# EAGLE schematic schematic_projektpraktikum_v2 (EAGLE 7.7.0)
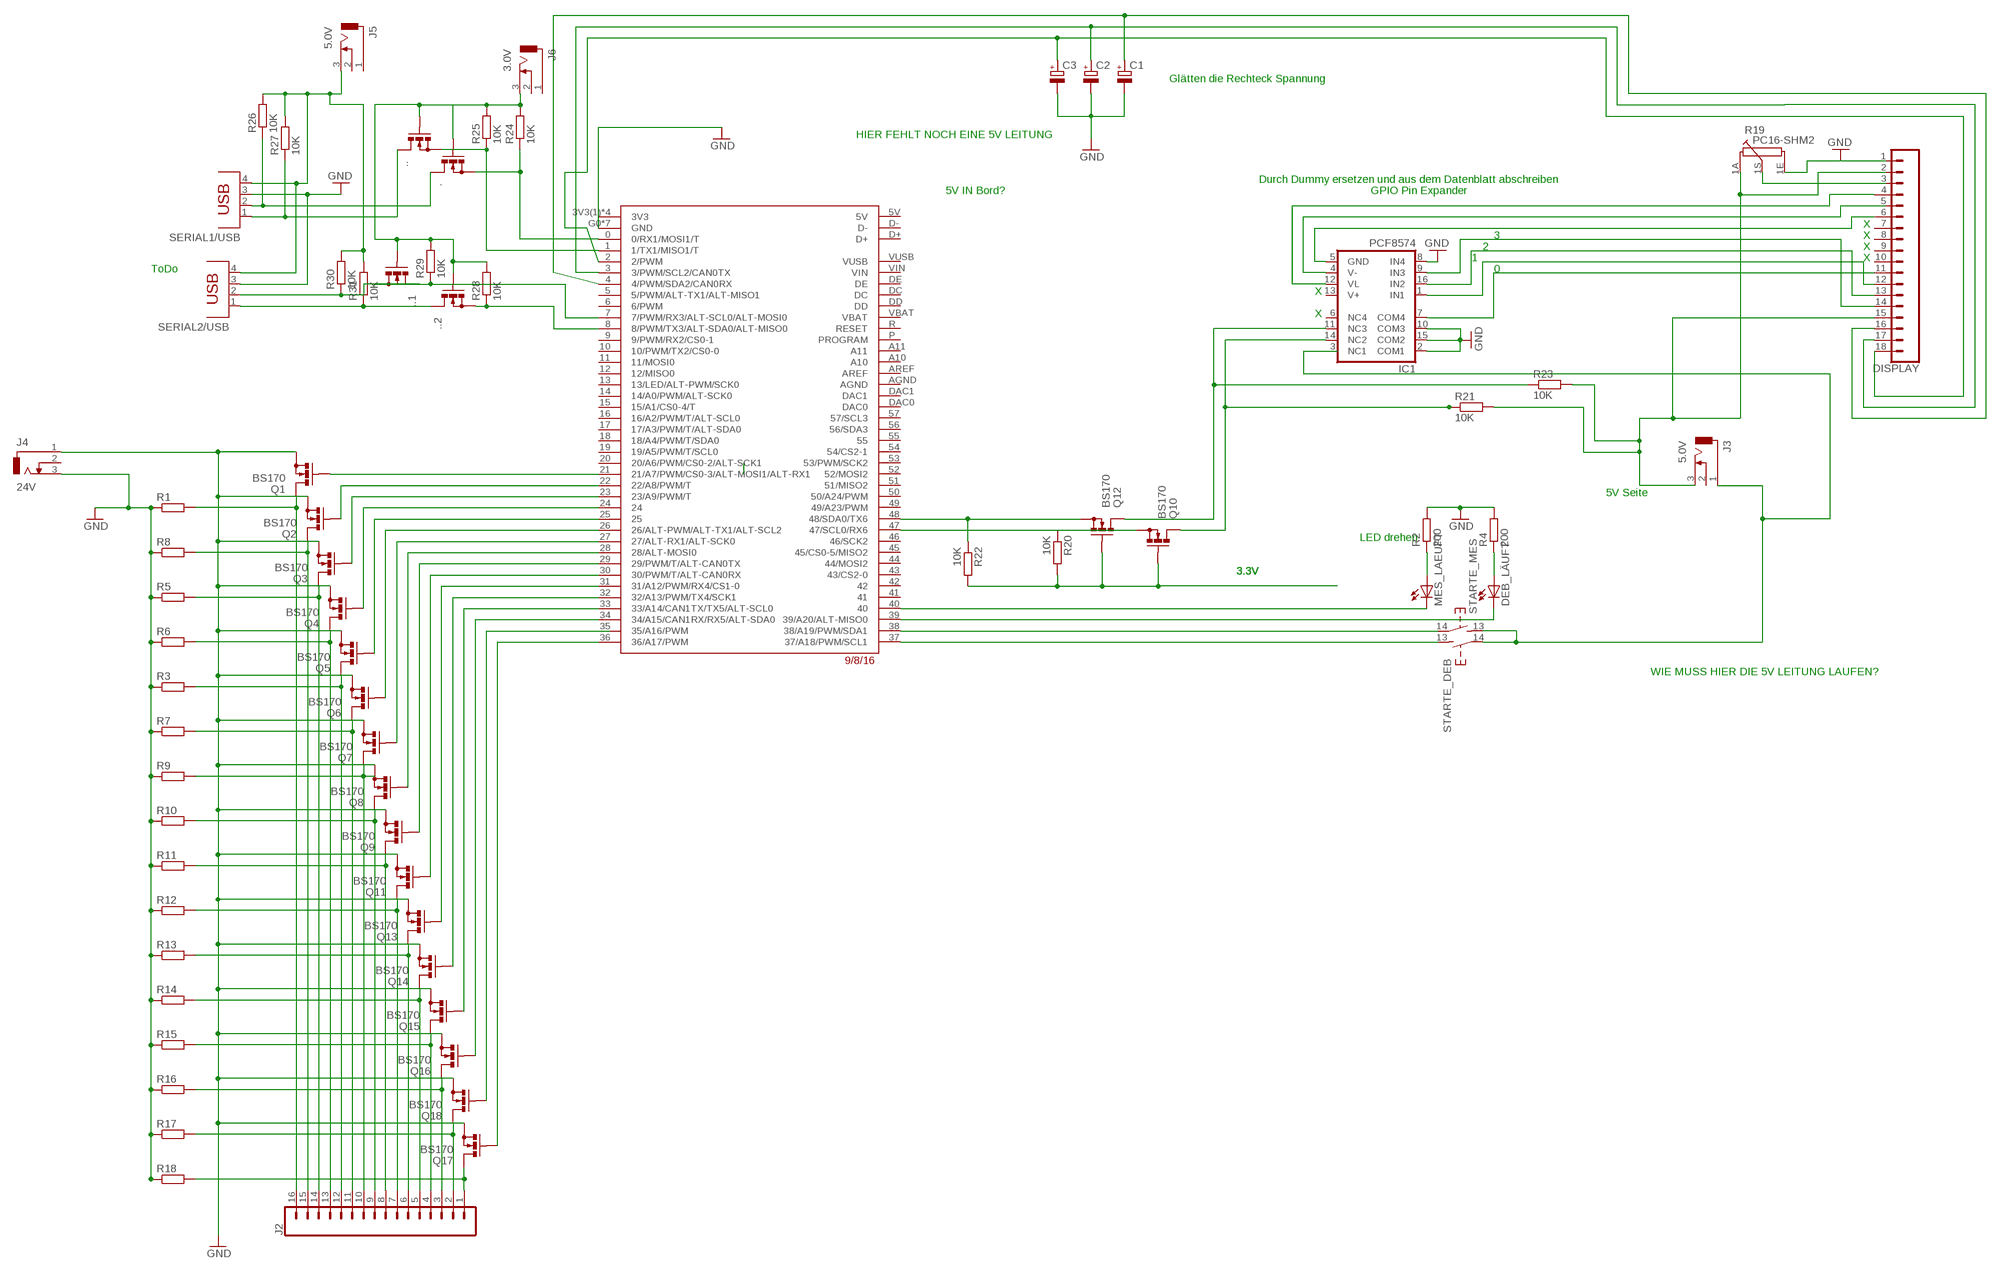
[diagram p0: schematic, sheet 1]

## Parts
.  BS170  [SOT54E]
..  BS170  [SOT54E]
..1  BS170  [SOT54E]
..2  BS170  [SOT54E]
C1  CPOL-EUE25-10AXIAL  [E25-10]
C2  CPOL-EUE25-10AXIAL  [E25-10]
C3  CPOL-EUE25-10AXIAL  [E25-10]
DEB_LÄUFT  LED5MM  [LED5MM]
DISPLAY  CONN_18  [1X18]
IC1  PCF8574  MAX312PE  [DIL16]
J2  CONN_16  [1X16]
J3  5.0V  DCJ0303  [DCJ0303]
J4  24V  DCJ0303  [DCJ0303]
J5  5.0V  DCJ0303  [DCJ0303]
J6  3.0V  DCJ0303  [DCJ0303]
MES_LAEUFT  LED5MM  [LED5MM]
Q1  BS170  [SOT54E]
Q2  BS170  [SOT54E]
Q3  BS170  [SOT54E]
Q4  BS170  [SOT54E]
Q5  BS170  [SOT54E]
Q6  BS170  [SOT54E]
Q7  BS170  [SOT54E]
Q8  BS170  [SOT54E]
Q9  BS170  [SOT54E]
Q10  BS170  [SOT54E]
Q11  BS170  [SOT54E]
Q12  BS170  [SOT54E]
Q13  BS170  [SOT54E]
Q14  BS170  [SOT54E]
Q15  BS170  [SOT54E]
Q16  BS170  [SOT54E]
Q17  BS170  [SOT54E]
Q18  BS170  [SOT54E]
R1  R-EU_0411/15  [0411/15]
R2  200  R-EU_0204/5  [0204/5]
R3  R-EU_0411/15  [0411/15]
R4  200  R-EU_0204/5  [0204/5]
R5  R-EU_0411/15  [0411/15]
R6  R-EU_0411/15  [0411/15]
R7  R-EU_0411/15  [0411/15]
R8  R-EU_0411/15  [0411/15]
R9  R-EU_0411/15  [0411/15]
R10  R-EU_0411/15  [0411/15]
R11  R-EU_0411/15  [0411/15]
R12  R-EU_0411/15  [0411/15]
R13  R-EU_0411/15  [0411/15]
R14  R-EU_0411/15  [0411/15]
R15  R-EU_0411/15  [0411/15]
R16  R-EU_0411/15  [0411/15]
R17  R-EU_0411/15  [0411/15]
R18  R-EU_0411/15  [0411/15]
R19  PC16-SHM2  [PC16-SHM2]
R20  10K  R-EU_0411/15  [0411/15]
R21  10K  R-EU_0411/15  [0411/15]
R22  10K  R-EU_0411/15  [0411/15]
R23  10K  R-EU_0411/15  [0411/15]
R24  10K  R-EU_0411/15  [0411/15]
R25  10K  R-EU_0411/15  [0411/15]
R26  10K  R-EU_0411/15  [0411/15]
R27  10K  R-EU_0411/15  [0411/15]
R28  10K  R-EU_0411/15  [0411/15]
R29  10K  R-EU_0411/15  [0411/15]
R30  10K  R-EU_0411/15  [0411/15]
R31  10K  R-EU_0411/15  [0411/15]
SERIAL1/USB  PN87520  [PN87520]
SERIAL2/USB  PN87520  [PN87520]
STARTE_DEB  TASTER_SCHLIESSER  [EINTASTER]
STARTE_MES  TASTER_SCHLIESSER  [EINTASTER]
U$1  TEENSY3_6--ALLPINS  [T36]

## Nets
.: ..D R26.1 SERIAL1/USB.2
DISPLAY: J5.3 R26.2 R27.2 R30.2 R31.2 SERIAL1/USB.4 SERIAL2/USB.4
GND: C1.- C2.- C3.- IC1.2(COM1) IC1.8(IN4) IC1.10(COM3) IC1.15(COM2) J4.3 R1.1 R2.2 R3.1 R4.2 R5.1 R6.1 R7.1 R8.1 R9.1 R10.1 R11.1 R12.1 R13.1 R14.1 R15.1 R16.1 R17.1 R18.1 R19.1E SERIAL1/USB.3 SERIAL2/USB.3 U$1.G0(GND) U$1.G1(GND) U$1.G2(GND) U$1.G3(GND) U$1.G4(GND) U$1.G5(GND) U$1.G6(GND)
N$1: ...S R25.1 U$1.1(1/TX1/MISO1/T)
N$2: ..1.S R29.1 U$1.7(7/PWM/RX3/ALT-SCL0/ALT-MOSI0)
N$3: ..1.D R30.1 SERIAL2/USB.2
N$5: ..2.D R31.1 SERIAL2/USB.1
N$8: STARTE_MES.14 U$1.38(38/A19/PWM/SDA1)
N$9: J2.16 Q1.D R1.2
N$12: J4.1 Q1.S Q2.S Q3.S Q4.S Q5.S Q6.S Q7.S Q8.S Q9.S Q11.S Q13.S Q14.S Q15.S Q16.S Q17.S Q18.S
N$13: Q1.G U$1.21(21/A7/PWM/CS0-3/ALT-MOSI1/ALT-RX1)
N$14: J2.14 Q3.D R5.2
N$15: MES_LAEUFT.A R2.1
N$16: MES_LAEUFT.K(C) U$1.40
N$17: DEB_LÄUFT.A R4.1
N$18: DEB_LÄUFT.K(C) U$1.39(39/A20/ALT-MISO0)
N$19: STARTE_DEB.13 U$1.37(37/A18/PWM/SCL1)
N$20: Q2.G U$1.22(22/A8/PWM/T)
N$21: J2.13 Q4.D R6.2
N$22: J2.12 Q5.D R3.2
N$23: Q4.G U$1.24
N$24: Q5.G U$1.25
N$25: R19.1S
N$26: J2.8 Q9.D R11.2
N$27: J2.9 Q8.D R10.2
N$28: J2.7 Q11.D R12.2
N$29: Q8.G U$1.28(28/ALT-MOSI0)
N$30: Q9.G U$1.29(29/PWM/T/ALT-CAN0TX)
N$31: Q11.G U$1.30(30/PWM/T/ALT-CAN0RX)
N$32: J2.1 Q17.D R18.2
N$33: J2.6 Q13.D R13.2
N$34: Q10.G Q12.G R20.2 R22.2
N$35: Q3.G U$1.23(23/A9/PWM/T)
N$36: J2.15 Q2.D R8.2
N$37: J2.11 Q6.D R7.2
N$38: J2.10 Q7.D R9.2
N$39: Q6.G U$1.26(26/ALT-PWM/ALT-TX1/ALT-SCL2)
N$40: Q7.G U$1.27(27/ALT-RX1/ALT-SCK0)
N$41: J2.5 Q14.D R14.2
N$42: J2.4 Q15.D R15.2
N$43: J2.3 Q16.D R16.2
N$44: J2.2 Q18.D R17.2
N$45: Q13.G U$1.31(31/A12/PWM/RX4/CS1-0)
N$46: Q14.G U$1.32(32/A13/PWM/TX4/SCK1)
N$47: Q15.G U$1.33(33/A14/CAN1TX/TX5/ALT-SCL0)
N$48: Q16.G U$1.34(34/A15/CAN1RX/RX5/ALT-SDA0)
N$49: Q18.G U$1.35(35/A16/PWM)
N$50: Q17.G U$1.36(36/A17/PWM)
N$51: DISPLAY.17
N$52: ..2.S R28.1 U$1.8(8/PWM/TX3/ALT-SDA0/ALT-MISO0)
N$53: DISPLAY.15 J3.3 R19.1A R21.2 R23.2
N$54: Q10.D R21.1
N$55: IC1.11(NC3) Q12.D R23.1
N$56: DISPLAY.4 IC1.12(VL)
N$57: Q12.S R22.1 U$1.48(48/SDA0/TX6)
N$58: J3.1 STARTE_DEB.14 STARTE_MES.13
N$59: DISPLAY.5 IC1.4(V-)
N$60: DISPLAY.6 IC1.5(GND)
N$61: DISPLAY.14 IC1.9(IN3)
N$62: ..1.G ..2.G ...G ..G J6.3 R24.2 R25.2 R28.2 R29.2
N$63: ...D R27.1 SERIAL1/USB.1
N$64: DISPLAY.13 IC1.16(IN2)
N$65: DISPLAY.12 IC1.1(IN1)
N$66: DISPLAY.11 IC1.7(COM4)
N$67: ..S R24.1 U$1.0(0/RX1/MOSI1/T)
N$68: C3.+ DISPLAY.18 U$1.2(2/PWM)
N$69: C2.+ U$1.3(3/PWM/SCL2/CAN0TX)
N$70: C1.+ DISPLAY.16 U$1.4(4/PWM/SDA2/CAN0RX)
SCL3.3: Q10.S R20.1 U$1.47(47/SCL0/RX6)
Unconnected: DISPLAY.1 DISPLAY.2 DISPLAY.3 DISPLAY.7 DISPLAY.8 DISPLAY.9 DISPLAY.10 IC1.3(NC1) IC1.6(NC4) IC1.14(NC2) J3.2 J4.2 J5.1 J5.2 J6.1 J6.2 R19.M1 R19.M2 R19.M3 R19.M4 U$1.3V3(1)(3V3) U$1.3V3(2)(3V3) U$1.3V3(3)(3V3) U$1.3V3(4)(3V3) U$1.5(5/PWM/ALT-TX1/ALT-MISO1) U$1.5V U$1.6(6/PWM) U$1.9(9/PWM/RX2/CS0-1) U$1.10(10/PWM/TX2/CS0-0) U$1.11(11/MOSI0) U$1.12(12/MISO0) U$1.13(13/LED/ALT-PWM/SCK0) U$1.14(14/A0/PWM/ALT-SCK0) U$1.15(15/A1/CS0-4/T) U$1.16(16/A2/PWM/T/ALT-SCL0) U$1.17(17/A3/PWM/T/ALT-SDA0) U$1.18(18/A4/PWM/T/SDA0) U$1.19(19/A5/PWM/T/SCL0) U$1.20(20/A6/PWM/CS0-2/ALT-SCK1) U$1.41 U$1.42 U$1.43(43/CS2-0) U$1.44(44/MOSI2) U$1.45(45/CS0-5/MISO2) U$1.46(46/SCK2) U$1.49(49/A23/PWM) U$1.50(50/A24/PWM) U$1.51(51/MISO2) U$1.52(52/MOSI2) U$1.53(53/PWM/SCK2) U$1.54(54/CS2-1) U$1.55 U$1.56(56/SDA3) U$1.57(57/SCL3) U$1.A10 U$1.A11 U$1.AGND U$1.AREF U$1.D+ U$1.D- U$1.DAC0 U$1.DAC1 U$1.DC U$1.DD U$1.DE U$1.P(PROGRAM) U$1.R(RESET) U$1.VBAT U$1.VIN U$1.VUSB

## Notes on the sheet
- Glätten die Rechteck Spannung
- HIER FEHLT NOCH EINE 5V LEITUNG
- Durch Dummy ersetzen und aus dem Datenblatt abschreiben
- 5V IN Bord? | GPIO Pin Expander
- X
- 3 | X
- 2 | X
- 1 | X
- ToDo | 0
- X
- X
- 5V Seite
- LED drehen
- 3.3V | 3.3V
- WIE MUSS HIER DIE 5V LEITUNG LAUFEN?

## Power pins joined to a net without a drawn wire
V+: IC1.13(V+)

## Library data of the parts
. .. ..1 ..2 Q1-Q18 = transistor-small-signal:BS170: N-CHANNEL MOS FET
C1-C3 = rcl:CPOL-EU: POLARIZED CAPACITOR, European symbol
DEB_LÄUFT MES_LAEUFT = led:LED: LED OSRAM: - CHIPLED LG R971, LG N971, LY N971, LG Q971, LY Q971, LO R971, LY R971 LH N974, LH R974 LS Q976, LO Q976, LY Q976 LO Q996 - Hyper CHIPLED LW Q18S LB Q993, LB Q99A, LB R99A - SideLED LS A670, LO A670, LY A670, LG A670, LP A670 LB A673, LV A673, LT A673, LW A673 LH A674 LY A675 LS A676, LA A676, LO A676, LY A676, LW A676 LS A679, LY A679, LG A679 - Hyper Micro SIDELED® LS Y876, LA Y876, LO Y876, LY Y876 LT Y87S - SmartLED LW L88C, LW L88S LB L89C, LB L89S, LG L890 LS L89K, LO L89K, LY L89K LS L896, LA L896, LO L896, LY L896 - TOPLED LS T670, LO T670, LY T670, LG T670, LP T670 LSG T670, LSP T670, LSY T670, LOP T670, LYG T670 LG T671, LOG T671, LSG T671 LB T673, LV T673, LT T673, LW T673 LH T674 LS T676, LA T676, LO T676, LY T676, LB T676, LH T676, LSB T676, LW T676 LB T67C, LV T67C, LT T67C, LS T67K, LO T67K, LY T67K, LW E67C LS E67B, LA E67B, LO E67B, LY E67B, LB E67C, LV E67C, LT E67C LW T67C LS T679, LY T679, LG T679 LS T770, LO T770, LY T770, LG T770, LP T770 LB T773, LV T773, LT T773, LW T773 LH T774 LS E675, LA E675, LY E675, LS T675 LS T776, LA T776, LO T776, LY T776, LB T776 LHGB T686 LT T68C, LB T68C - Hyper Mini TOPLED® LB M676 - Mini TOPLED Santana® LG M470 LS M47K, LO M47K, LY M47K Source: http://www.osram.convergy.de LUXEON: - LUMILED® LXK2-PW12-R00, LXK2-PW12-S00, LXK2-PW14-U00, LXK2-PW14-V00 LXK2-PM12-R00, LXK2-PM12-S00, LXK2-PM14-U00 LXK2-PE12-Q00, LXK2-PE12-R00, LXK2-PE12-S00, LXK2-PE14-T00, LXK2-PE14-U00 LXK2-PB12-K00, LXK2-PB12-L00, LXK2-PB12-M00, LXK2-PB14-N00, LXK2-PB14-P00, LXK2-PB14-Q00 LXK2-PR12-L00, LXK2-PR12-M00, LXK2-PR14-Q00, LXK2-PR14-R00 LXK2-PD12-Q00, LXK2-PD12-R00, LXK2-PD12-S00 LXK2-PH12-R00, LXK2-PH12-S00 LXK2-PL12-P00, LXK2-PL12-Q00, LXK2-PL12-R00 Source: www.luxeon.com KINGBRIGHT: KA-3528ASYC Source: www.kingbright.com
DISPLAY = SPARKFUN-CONNECTOR:CONN_18: Multi connection point. Often used as Generic Header-pin footprint for 0.1 inch spaced/style header connections On any of the 0.1 inch spaced packages, you can populate with these: Break Away Headers - Straight <https://www.sparkfun.com/products/116> (PRT-00116) Break Away Male Headers - Right Angle <https://www.sparkfun.com/products/553> (PRT-00553) Female Headers <https://www.sparkfun.com/products/115> (PRT-00115) Break Away Headers - Machine Pin <https://www.sparkfun.com/products/117> (PRT-00117) Break Away Female Headers - Swiss Machine Pin <https://www.sparkfun.com/products/743> (PRT-00743) For SCREWTERMINALS and SPRING TERMINALS visit here: Screw Terimnals on SparkFun.com <https://www.sparkfun.com/search/results?term=Screw+Terminals> (5mm/3.5mm/2.54mm spacing) This device is also useful as a general connection point to wire up your design to another part of your project. Our various solder wires solder well into these plated through hole pads. Hook-Up Wire - Assortment (Stranded, 22 AWG) <https://www.sparkfun.com/products/11375> (PRT-11375) Hook-Up Wire - Assortment (Solid Core, 22 AWG) <https://www.sparkfun.com/products/11367> (PRT-11367) View the entire wire category on our website here <https://www.sparkfun.com/categories/141> Special notes: Molex polarized connector foot print use with SKU : PRT-08231 with associated crimp pins and housings. 1MM SMD Version SKU: PRT-10208 NOTES ON THE VARIANTS LOCK and LOCK_LONGPADS... This footprint was designed to help hold the alignment of a through-hole component (i.e. 6-pin header) while soldering it into place. You may notice that each hole has been shifted either up or down by 0.005 of an inch from it's more standard position (which is a perfectly straight line). This slight alteration caused the pins (the squares in the middle) to touch the edges of the holes. Because they are alternating, it causes a "brace" to hold the component in place. 0.005 has proven to be the perfect amount of "off-center" position when using our standard breakaway headers. Although looks a little odd when you look at the bare footprint, once you have a header in there, the alteration is very hard to notice. Also,if you push a header all the way into place, it is covered up entirely on the bottom side.
IC1 = maxim:MAX312: 10?, Quad, SPST, CMOS Analog Switches Source: http://datasheets.maxim-ic.com/en/ds/MAX312-MAX314.pdf; OC_FARNELL: unknown; OC_NEWARK: unknown
J2 = SparkFun-Connectors:CONN_16: Multi connection point. Often used as Generic Header-pin footprint for 0.1 inch spaced/style header connections On any of the 0.1 inch spaced packages, you can populate with these: Break Away Headers - Straight <https://www.sparkfun.com/products/116> (PRT-00116) Break Away Male Headers - Right Angle <https://www.sparkfun.com/products/553> (PRT-00553) Female Headers <https://www.sparkfun.com/products/115> (PRT-00115) Break Away Headers - Machine Pin <https://www.sparkfun.com/products/117> (PRT-00117) Break Away Female Headers - Swiss Machine Pin <https://www.sparkfun.com/products/743> (PRT-00743) For SCREWTERMINALS and SPRING TERMINALS visit here: Screw Terimnals on SparkFun.com <https://www.sparkfun.com/search/results?term=Screw+Terminals> (5mm/3.5mm/2.54mm spacing) This device is also useful as a general connection point to wire up your design to another part of your project. Our various solder wires solder well into these plated through hole pads. Hook-Up Wire - Assortment (Stranded, 22 AWG) <https://www.sparkfun.com/products/11375> (PRT-11375) Hook-Up Wire - Assortment (Solid Core, 22 AWG) <https://www.sparkfun.com/products/11367> (PRT-11367) View the entire wire category on our website here <https://www.sparkfun.com/categories/141> Special notes: Molex polarized connector foot print use with SKU : PRT-08231 with associated crimp pins and housings. 1MM SMD Version SKU: PRT-10208 NOTES ON THE VARIANTS LOCK and LOCK_LONGPADS... This footprint was designed to help hold the alignment of a through-hole component (i.e. 6-pin header) while soldering it into place. You may notice that each hole has been shifted either up or down by 0.005 of an inch from it's more standard position (which is a perfectly straight line). This slight alteration caused the pins (the squares in the middle) to touch the edges of the holes. Because they are alternating, it causes a "brace" to hold the component in place. 0.005 has proven to be the perfect amount of "off-center" position when using our standard breakaway headers. Although looks a little odd when you look at the bare footprint, once you have a header in there, the alteration is very hard to notice. Also,if you push a header all the way into place, it is covered up entirely on the bottom side.
J3-J6 = con-jack:DCJ0303: DC POWER JACK Source: DCJ0303.pdf; OC_FARNELL: unknown; OC_NEWARK: unknown
R1-R18 R20-R31 = resistor:R-EU_: RESISTOR, European symbol
R19 = piher:PC16-SHM2: POTENTIOMETER single carbon potentiometer, 16 mm, S3ROH; OC_FARNELL: unknown; OC_NEWARK: unknown
SERIAL1/USB SERIAL2/USB = con-berg:PN87520: BERG USB connector; OC_FARNELL: unknown; OC_NEWARK: unknown
STARTE_DEB STARTE_MES = e-schalter:TASTER_SCHLIESSER: Ein-Taster (Arbeitskontakt)
U$1 = Teensy_3_6:TEENSY3_6--ALLPINS

## Module DISPLAY
Ports: 

### Library data of the parts